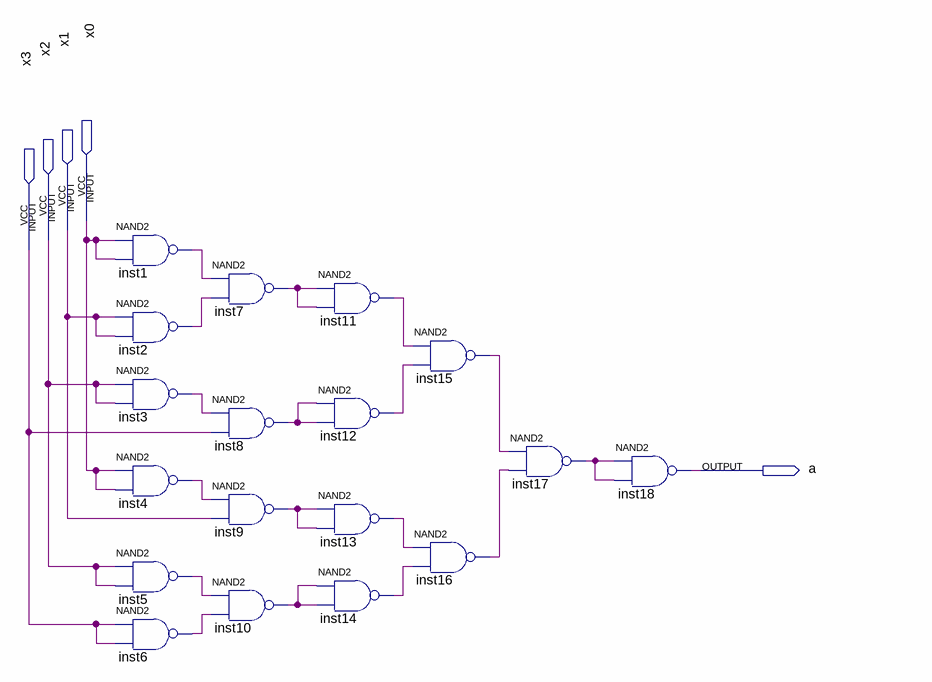
[diagram p0: schematic sheet]
// Quartus schematic DZ1_Quartus_A.bdf as structural Verilog: 18 symbols, 5 pins
module DZ1_Quartus_A (
  input  x0,
  input  x1,
  input  x2,
  input  x3,
  output a
);

  wire inst1_out, inst2_out, inst3_out, inst4_out, inst5_out, inst6_out, inst7_out, inst8_out, inst9_out,
       inst10_out, inst11_out, inst12_out, inst13_out, inst14_out, inst15_out, inst16_out, inst17_out;

  nand inst1 (inst1_out, x0, x0);
  nand inst2 (inst2_out, x1, x1);
  nand inst3 (inst3_out, x2, x2);
  nand inst4 (inst4_out, x0, x0);
  nand inst5 (inst5_out, x2, x2);
  nand inst6 (inst6_out, x3, x3);
  nand inst7 (inst7_out, inst1_out, inst2_out);
  nand inst8 (inst8_out, inst3_out, x3);
  nand inst9 (inst9_out, inst4_out, x1);
  nand inst10 (inst10_out, inst5_out, inst6_out);
  nand inst11 (inst11_out, inst7_out, inst7_out);
  nand inst12 (inst12_out, inst8_out, inst8_out);
  nand inst13 (inst13_out, inst9_out, inst9_out);
  nand inst14 (inst14_out, inst10_out, inst10_out);
  nand inst15 (inst15_out, inst11_out, inst12_out);
  nand inst16 (inst16_out, inst13_out, inst14_out);
  nand inst17 (inst17_out, inst15_out, inst16_out);
  nand inst18 (a, inst17_out, inst17_out);
endmodule
